# Altium schematic sheet Sheet1.SchDoc
size A2; SheetNumber: 1; SheetTotal: 1
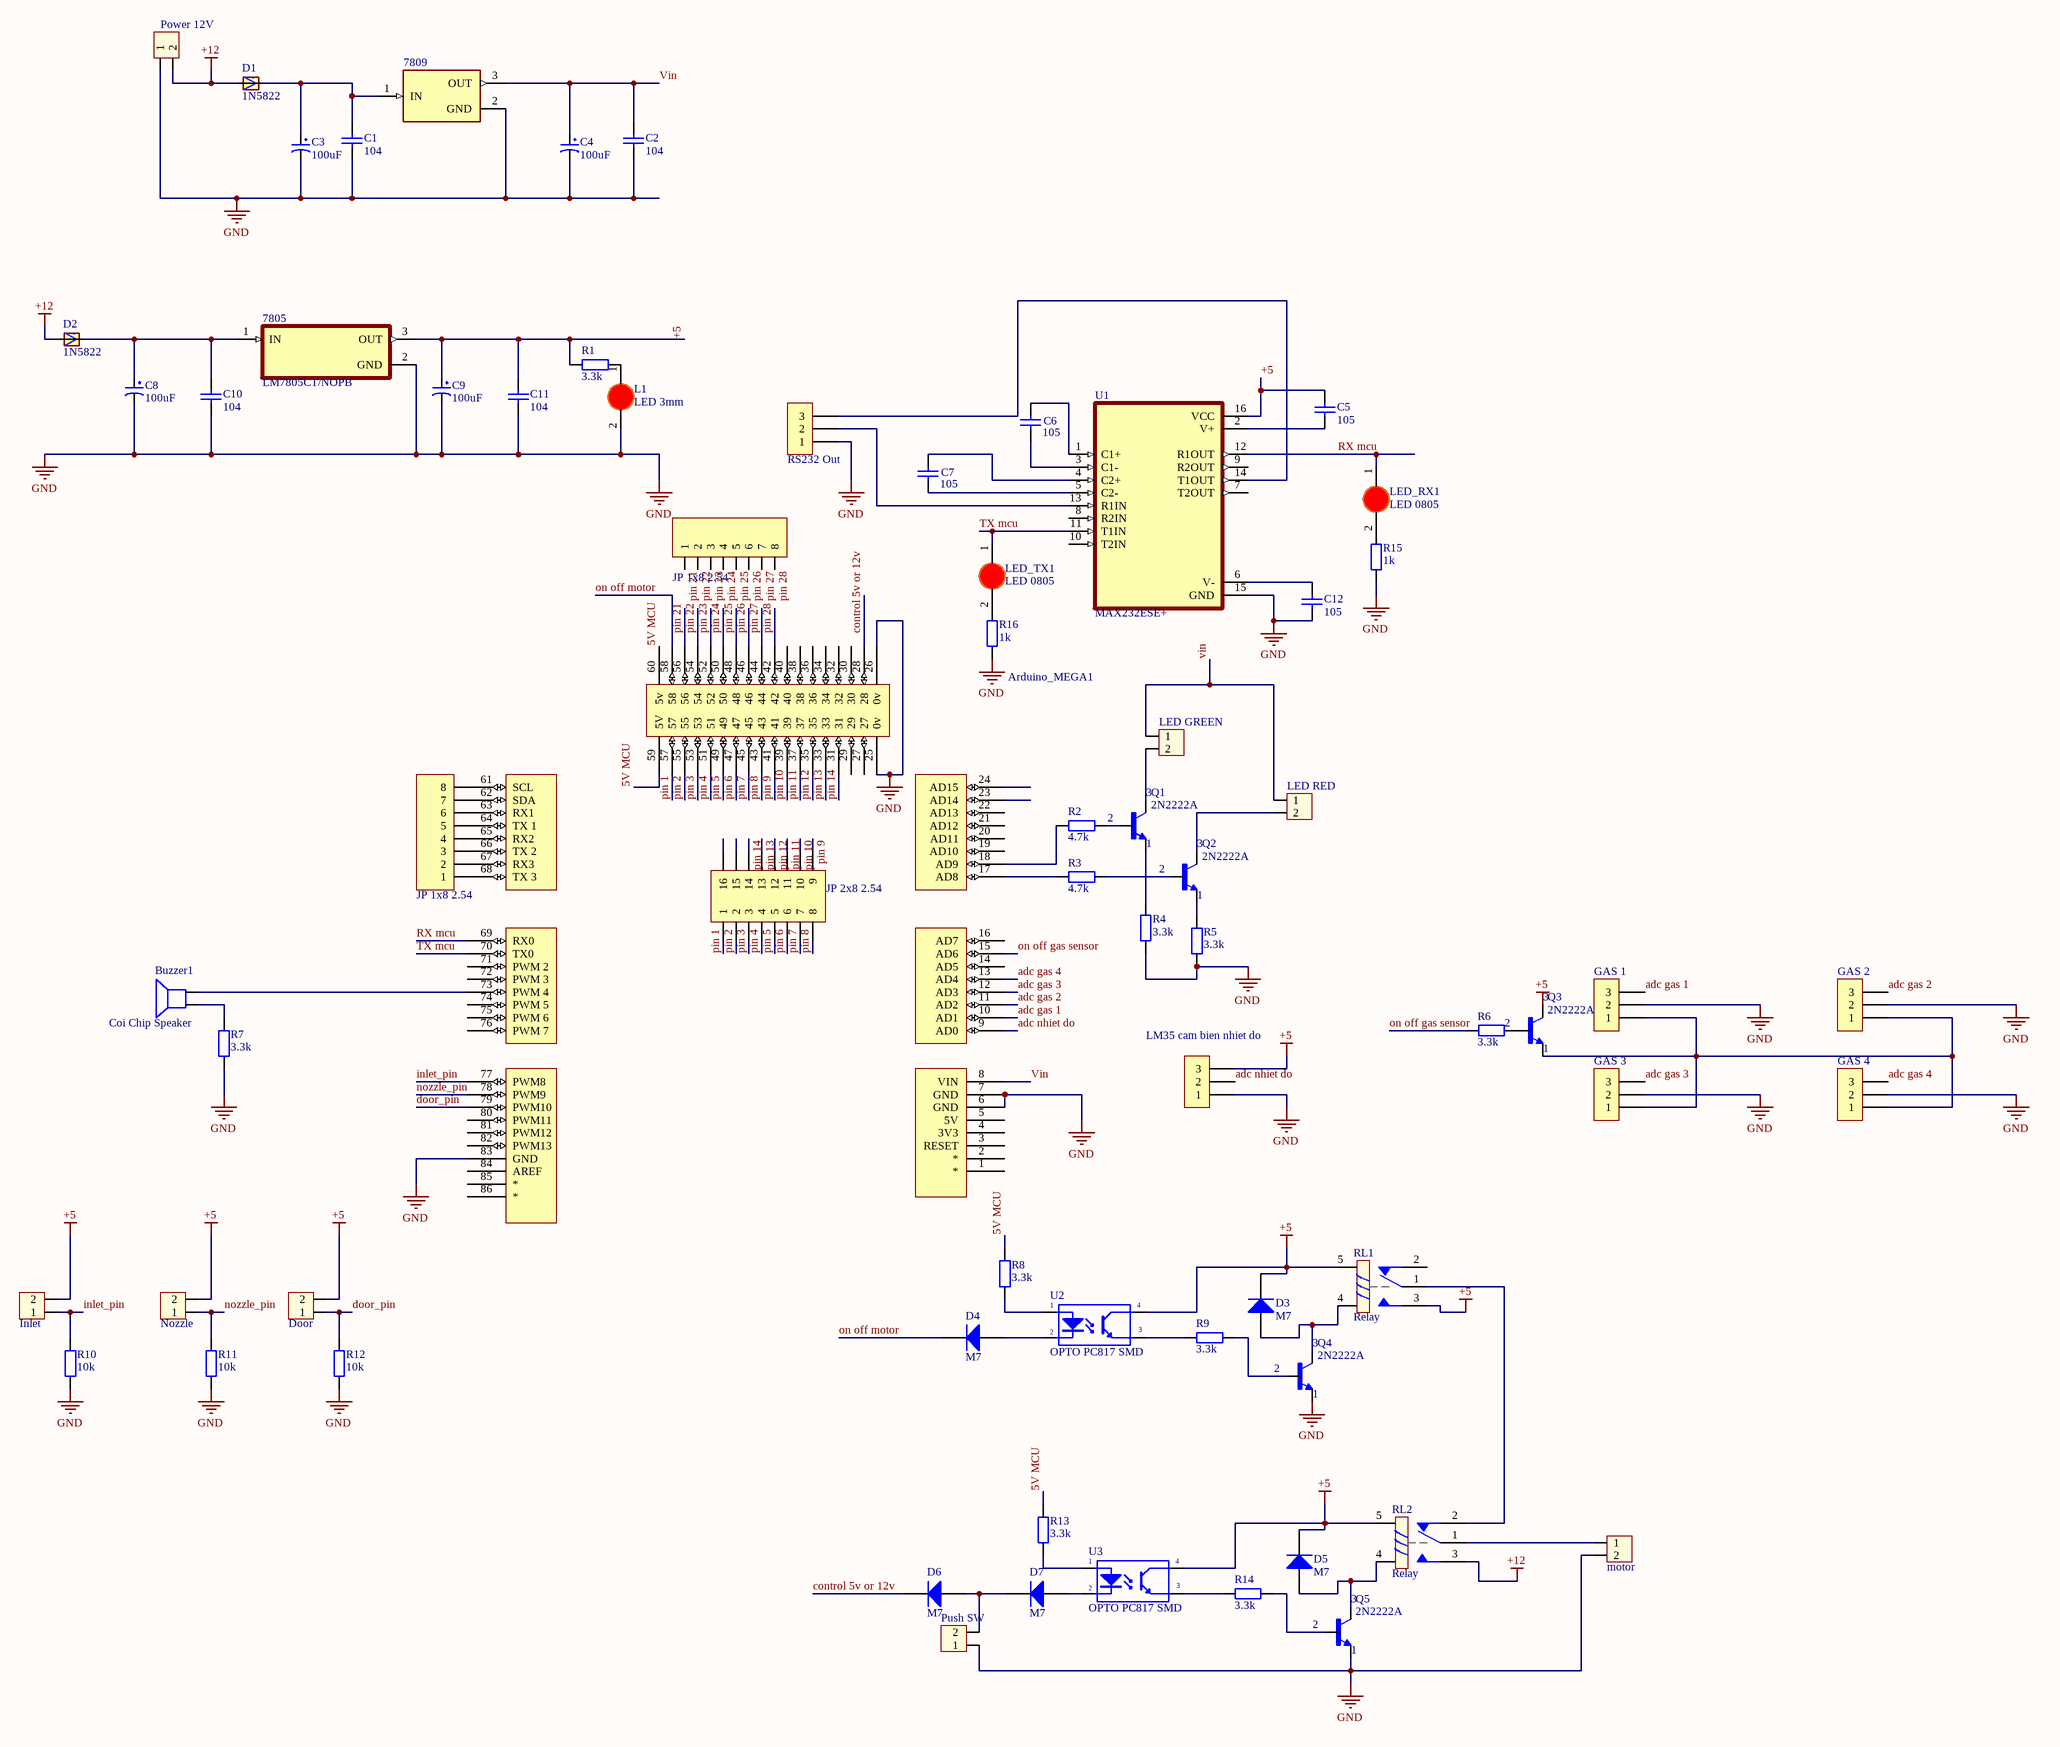
[diagram p0: Sheet1.SchDoc]

## Parts
(Parts that share a designator on the sheet are numbered #1, #2 ... from top to bottom, then left to right.)
7805  LM7805CT/NOPB  [TO254P1054X470X1955-3]
7809  LM7809CT  [TO254P470X1016X1879-3P]  (value not drawn)
Arduino_MEGA1  Arduino_MEGA?  [ArduinoMEGA_ALL]  (value not drawn)
Buzzer1  Coi Chip Speaker  [Coi Chip Speacker]
C1  104  [tu 1206]
C2  104  [tu 1206]
C3  100uF  [tu hoa 5mm]
C4  100uF  [tu hoa 5mm]
C5  105  [tu 0805]
C6  105  [tu 0805]
C7  105  [tu 0805]
C8  100uF  [tu hoa 5mm]
C9  100uF  [tu hoa 5mm]
C10  104  [tu 1206]
C11  104  [tu 1206]
C12  105  [tu 0805]
D1  1N5822  [DIOAD2120W130L950D530P]
D2  1N5822  [DIOAD2120W130L950D530P]
D3  M7  [DIODE SMA]
D4  M7  [DIODE SMA]
D5  M7  [DIODE SMA]
D6  M7  [DIODE SMA]
D7  M7  [DIODE SMA]
door1  Door  [XH2.54M-2]
GAS_1  Gas Sensor 1  [XH2.54M-3]  (value not drawn)
GAS_2  Gas Sensor 3  [XH2.54M-3]  (value not drawn)
GAS_3  Gas Sensor 2  [XH2.54M-3]  (value not drawn)
GAS_4  Gas Sensor 4  [XH2.54M-3]  (value not drawn)
H1  Power 12V  [VH3.96M-2]
H2  RS232 Out  [VH3.96M-3]
inlet1  Inlet  [XH2.54M-2]
JP1#1  JP 1x8 2.54  [JP 1x8 DT]
JP1#2  JP 2x8 2.54  [JP 2x8 CT]
JP?  JP 1x8 2.54  [JP 1x8 CT]
L1  LED 3mm  [LED-3MM-RED]
LED_GREEN  Led GREEN  [XH2.54M-2]  (value not drawn)
LED_RED  Led RED  [XH2.54M-2]  (value not drawn)
LED_RX1  LED 0805  [LED-1206-Red]
LED_TX1  LED 0805  [LED-1206-Red]
Motor1  motor  [VH3.96M-2]
nozzle1  Nozzle  [XH2.54M-2]
Push_SW  Header 2P VH3.96 Duc Thang  [VH3.96M-2]  (value not drawn)
Q1  2N2222A  [TO92254P470H750-3]
Q2  2N2222A  [TO92254P470H750-3]
Q3  2N2222A  [TO92254P470H750-3]
Q4  2N2222A  [TO92254P470H750-3]
Q5  2N2222A  [TO92254P470H750-3]
R1  3.3k  [tro smd 0805]
R2  4.7k  [tro smd 0805]
R3  4.7k  [tro smd 0805]
R4  3.3k  [tro smd 0805]
R5  3.3k  [tro smd 0805]
R6  3.3k  [tro smd 0805]
R7  3.3k  [tro smd 0805]
R8  3.3k  [tro smd 0805]
R9  3.3k  [tro smd 0805]
R10  10k  [tro smd 0805]
R11  10k  [tro smd 0805]
R12  10k  [tro smd 0805]
R13  3.3k  [tro smd 0805]
R14  3.3k  [tro smd 0805]
R15  1k  [tro smd 0805]
R16  1k  [tro smd 0805]
RL1  Relay  [Relay 5 Chan SRD]
RL2  Relay  [Relay 5 Chan SRD]
Temperature_Header1  LM35 cam bien nhiet do  [XH2.54M-3]
U1  MAX232ESE+  [SOIC127P600X175-16N]
U2  OPTO PC817 SMD  [SOP4]
U3  OPTO PC817 SMD  [SOP4]

## Nets
+5: 7805.3(OUT) C5.1 C9.1 C11.1 D3.2(K) D5.2(K) door1.2 inlet1.2 nozzle1.2 Q3.3(C) R1.2 RL1.3 RL1.5 RL2.5 Temperature_Header1.3 U1.16(VCC) U2.4(C) U3.4(C)
+12: D1.A D2.A H1.2 RL2.3
GND: 7805.2(GND) 7809.2(GND) Arduino_MEGA1.6(GND) Arduino_MEGA1.7(GND) Arduino_MEGA1.25(0v) Arduino_MEGA1.26(0v) Arduino_MEGA1.83(GND) C1.2 C2.2 C3.2 C4.2 C8.2 C9.2 C10.2 C11.2 C12.1 GAS_1.2 GAS_2.2 GAS_3.2 GAS_4.2 H1.1 H2.1 L1.2(K) Motor1.2 Push_SW.1 Q4.1(E) Q5.1(E) R4.2 R5.2 R7.1 R10.1 R11.1 R12.1 R15.1 R16.1 Temperature_Header1.1 U1.15(GND)
5V MCU: Arduino_MEGA1.59(5V) Arduino_MEGA1.60(5v) R8.2 R13.2
adc gas 1: Arduino_MEGA1.10(AD1) GAS_1.3
adc gas 2: Arduino_MEGA1.11(AD2) GAS_2.3
adc gas 3: Arduino_MEGA1.12(AD3) GAS_3.3
adc gas 4: Arduino_MEGA1.13(AD4) GAS_4.3
adc nhiet do: Arduino_MEGA1.9(AD0) Temperature_Header1.2
control 5v or 12v: Arduino_MEGA1.28 D6.2(K)
door_pin: Arduino_MEGA1.79(PWM10) door1.1 R12.2
inlet_pin: Arduino_MEGA1.77(PWM8) inlet1.1 R10.2
nozzle_pin: Arduino_MEGA1.78(PWM9) nozzle1.1 R11.2
on off gas sensor: Arduino_MEGA1.15(AD6) R6.1
on off motor: Arduino_MEGA1.58 D4.2(K)
pin 1: Arduino_MEGA1.57 JP1#2.1
pin 2: Arduino_MEGA1.55 JP1#2.2
pin 3: Arduino_MEGA1.53 JP1#2.3
pin 4: Arduino_MEGA1.51 JP1#2.4
pin 5: Arduino_MEGA1.49 JP1#2.5
pin 6: Arduino_MEGA1.47 JP1#2.6
pin 7: Arduino_MEGA1.45 JP1#2.7
pin 8: Arduino_MEGA1.43 JP1#2.8
pin 9: Arduino_MEGA1.41 JP1#2.9
pin 10: Arduino_MEGA1.39 JP1#2.10
pin 11: Arduino_MEGA1.37 JP1#2.11
pin 12: Arduino_MEGA1.35 JP1#2.12
pin 13: Arduino_MEGA1.33 JP1#2.13
pin 14: Arduino_MEGA1.31 JP1#2.14
pin 21: Arduino_MEGA1.56 JP?.1
pin 22: Arduino_MEGA1.54 JP?.2
pin 23: Arduino_MEGA1.52 JP?.3
pin 24: Arduino_MEGA1.50 JP?.4
pin 25: Arduino_MEGA1.48 JP?.5
pin 26: Arduino_MEGA1.46 JP?.6
pin 27: Arduino_MEGA1.44 JP?.7
pin 28: Arduino_MEGA1.42 JP?.8
RX mcu: Arduino_MEGA1.69(RX0) LED_RX1.1(A) U1.12(R1OUT)
TX mcu: Arduino_MEGA1.70(TX0) LED_TX1.1(A) U1.11(T1IN)
Vin: 7809.3(OUT) Arduino_MEGA1.8(VIN) C2.1 C4.1 LED_GREEN.1 LED_RED.1
Net7805_1: 7805.1(IN) C8.1 C10.1 D2.C
Net7809_1: 7809.1(IN) C1.1 C3.1 D1.C
NetArduino_MEGA1_17: Arduino_MEGA1.17(AD8) R3.1
NetArduino_MEGA1_18: Arduino_MEGA1.18(AD9) R2.1
NetArduino_MEGA1_61: Arduino_MEGA1.61(SCL) JP1#1.8
NetArduino_MEGA1_62: Arduino_MEGA1.62(SDA) JP1#1.7
NetArduino_MEGA1_63: Arduino_MEGA1.63(RX1) JP1#1.6
NetArduino_MEGA1_64: Arduino_MEGA1.64(TX_1) JP1#1.5
NetArduino_MEGA1_65: Arduino_MEGA1.65(RX2) JP1#1.4
NetArduino_MEGA1_66: Arduino_MEGA1.66(TX_2) JP1#1.3
NetArduino_MEGA1_67: Arduino_MEGA1.67(RX3) JP1#1.2
NetArduino_MEGA1_68: Arduino_MEGA1.68(TX_3) JP1#1.1
NetArduino_MEGA1_73: Arduino_MEGA1.73(PWM_4) Buzzer1.2
NetBuzzer1_1: Buzzer1.1 R7.2
NetC5_2: C5.2 U1.2(V+)
NetC6_1: C6.1 U1.1(C1+)
NetC6_2: C6.2 U1.3(C1-)
NetC7_1: C7.1 U1.4(C2+)
NetC7_2: C7.2 U1.5(C2-)
NetC12_2: C12.2 U1.6(V-)
NetD3_1: D3.1(A) Q4.3(C) RL1.4
NetD4_1: D4.1(A) U2.2(K)
NetD5_1: D5.1(A) Q5.3(C) RL2.4
NetD6_1: D6.1(A) D7.2(K) Push_SW.2
NetD7_1: D7.1(A) U3.2(K)
NetGAS_1_1: GAS_1.1 GAS_2.1 GAS_3.1 GAS_4.1 Q3.1(E)
NetH2_2: H2.2 U1.13(R1IN)
NetH2_3: H2.3 U1.14(T1OUT)
NetL1_1: L1.1(A) R1.1
NetLED_GREEN_2: LED_GREEN.2 Q1.3(C)
NetLED_RED_2: LED_RED.2 Q2.3(C)
NetLED_RX1_2: LED_RX1.2(K) R15.2
NetLED_TX1_2: LED_TX1.2(K) R16.2
NetMotor1_1: Motor1.1 RL2.1
NetQ1_1: Q1.1(E) R4.1
NetQ1_2: Q1.2(B) R2.2
NetQ2_1: Q2.1(E) R5.1
NetQ2_2: Q2.2(B) R3.2
NetQ3_2: Q3.2(B) R6.2
NetQ4_2: Q4.2(B) R9.1
NetQ5_2: Q5.2(B) R14.1
NetR8_1: R8.1 U2.1(A)
NetR9_2: R9.2 U2.3(E)
NetR13_1: R13.1 U3.1(A)
NetR14_2: R14.2 U3.3(E)
NetRL1_1: RL1.1 RL2.2

Not connected (* = marked no-connect by the designer): Arduino_MEGA1 1(*) 2(*) 3(RESET) 4(3V3) 5(5V) 14(AD5) 16(AD7) 19(AD10) 20(AD11) 21(AD12) 22(AD13) 23(AD14) 24(AD15) 27 29 30 32 34 36 38 40 71(PWM_2) 72(PWM_3) 74(PWM_5) 75(PWM_6) 76(PWM_7) 80(PWM11) 81(PWM12) 82(PWM13) 84(AREF) 85(*) 86(*); JP1#2 15 16; RL1 2; U1 7(T2OUT) 8(R2IN) 9(R2OUT) 10(T2IN)

## Library data of the parts
7809 = LM7809CT: Linear Voltage Regulator IC 1 Output 1A TO-220-3; MF: Fujitsu; MP: LM7809C; Price: None; SnapEDA_Link: https://www.snapeda.com/parts/LM7809C/Fujitsu/view-part/1233224/?ref=snap; Package: TO-220-3 Fujitsu; Value: *; Availability: Unavailable
Arduino_MEGA1 = Arduino_MEGA
Buzzer1 = Coi Chip Speaker: Còi chip
C1 C2 C10 C11 = Tu 1206 104 50V 20%: Dán; Don_Vi: Con; So_Chan: 2; Ten_Linh_Kien: Tụ 1206 104-0.1uF 20% 50V; Ma_Hang: MH004544; Chung_Loai: Dán; Kieu_Chan: *
C3 C4 C8 C9 = Tu Hoa 100uF 25V 6x11: Cắm; Don_Vi: Con; So_Chan: 2; Ten_Linh_Kien: Tụ Hóa 100uF 25V 6x11MM; Ma_Hang: MH001351; Chung_Loai: Cắm; Kieu_Chan: *
C5-C7 C12 = Tu 0805 105 50V 10%: Dán; Don_Vi: Con; So_Chan: 2; Ten_Linh_Kien: Tụ 0805 105-1uF 10% 50V; Ma_Hang: MH004552; Chung_Loai: Dán; Kieu_Chan: *
D1 D2 = 1N5822: Diode Schottky 40 V 3A Through Hole DO-201AD; MF: STMicroelectronics; Value: *; SnapEDA_Link: https://www.snapeda.com/parts/1N5822/STMicroelectronics/view-part/?ref=snap; Purchase-URL: https://pricing.snapeda.com/search/part/1N5822/?ref=eda; Availability: In Stock; Price: None; Package: DO-201 STMicroelectronics; Check_prices: https://www.snapeda.com/parts/1N5822/STMicroelectronics/view-part/?ref=eda; MP: 1N5822
D3-D7 = Diode M7 ( 4007 ): Dán; Don_Vi: Con; Ten_Linh_Kien: Diode M7 1N4007 SMD 1A 1000V; Ma_Hang: MH000944; Chung_Loai: Dán; Ghi_Chu: *
door1 inlet1 LED_GREEN LED_RED nozzle1 = Header 2P 2.54 Duc Thang: Cắm; Ten_Linh_Kien: Header 2P XH2.54-2P Đực Thẳng; Don_Vi: Con; Ma_Hang: MH001283; Chung_Loai: Cắm
GAS_1-GAS_4 Temperature_Header1 = Header 3P 2.54 Duc Thang: Cắm; Ten_Linh_Kien: Header 3P XH2.54-3P Đực Thẳng; Don_Vi: Con; Ma_Hang: MH001292; Chung_Loai: Cắm
H1 Motor1 Push_SW = Header 2P VH3.96 Duc Thang: Cắm; Ten_Linh_Kien: Header 2P XH2.54-2P Đực Thẳng; Don_Vi: Con; Ma_Hang: MH001283; Chung_Loai: Cắm
H2 = Header 3P VH3.96 Duc Thang: Cắm; Ten_Linh_Kien: Header 3P XH2.54-3P Đực Thẳng; Don_Vi: Con; Ma_Hang: MH001292; Chung_Loai: Cắm
JP1#1 = JP 1x8 2.54 Duc Thang: Cắm; Ten_Linh_Kien: Jump Đơn Đực 2.54MM 1x40P Thẳng 11MM; Don_Vi: Con; Ma_Hang: MH000903; Ghi_Chu: *; Kieu_Chan: *; Chung_Loai: Cắm
JP1#2 = JP 2x8 2.54 Cai Thang: Cắm; Ten_Linh_Kien: Jump Đôi Cái 2.54MM 2x20P Thẳng; Don_Vi: Con; Ma_Hang: MH008647; Ghi_Chu: *; Kieu_Chan: *; Chung_Loai: Cắm
JP? = JP 1x8 2.54 Cai Thang: Cắm; Ten_Linh_Kien: Jump Đơn Cái 2.54MM 1x20P Thẳng; Don_Vi: Con; Ma_Hang: MH004006; Ghi_Chu: *; Kieu_Chan: *; Chung_Loai: Cắm
L1 = LED 3mm Do: Cắm; Don_Vi: Con; Ma_Hang: MH003892; Ten_Linh_Kien: Led 3MM Phủ Đỏ (10c); Ghi_Chu: *; Kieu_Chan: *; Chung_Loai: Cắm
LED_RX1 LED_TX1 = LED 1206 Do: Dán; Don_Vi: Con; Ma_Hang: MH002334; Ten_Linh_Kien: LED1206 Màu Đỏ (Red); Ghi_Chu: *; Kieu_Chan: *; Chung_Loai: Dán
Q1-Q5 = 2N2222A: Bipolar (BJT) Transistor NPN 40 V 600 mA 250MHz 625 mW Through Hole TO-92; MF: Diotec Semiconductor; Package: TO-92-3 Diotec; Check_prices: https://www.snapeda.com/parts/2N2222A/Diotec/view-part/?ref=eda; Value: *; Purchase-URL: https://pricing.snapeda.com/search/part/2N2222A/?ref=eda; Availability: In Stock; SnapEDA_Link: https://www.snapeda.com/parts/2N2222A/Diotec/view-part/?ref=snap; MP: 2N2222A; Price: None
R1 R4-R9 R13 R14 = Tro 0805 1% 3.3k: Dán; Don_Vi: Con; So_Chan: 2; Ten_Linh_Kien: Trở 0805 1% 3.3k; Ma_Hang: MH005472; Chung_Loai: Dán; Kieu_Chan: *
R2 R3 = Tro 0805 5% 4.7k: Dán; Don_Vi: Con; So_Chan: 2; Ten_Linh_Kien: Trở 0805 5% 4.7k; Ma_Hang: MH005307; Chung_Loai: Dán; Kieu_Chan: *
R10-R12 = Tro 0805 5% 10k: Dán; Don_Vi: Con; So_Chan: 2; Ten_Linh_Kien: Trở 0805 5% 10k; Ma_Hang: MH005239; Chung_Loai: Dán; Kieu_Chan: *
R15 R16 = Tro 0805 5% 1k: Dán; Don_Vi: Con; So_Chan: 2; Ten_Linh_Kien: Trở 0805 5% 1k; Ma_Hang: MH005234; Chung_Loai: Dán; Kieu_Chan: *
RL1 RL2 = Relay 5 Chan SRD: Relay 5 Chan; Ma_Hang: MH009374; Ten: Relay 5V10A SRD-05VDC-SL-C Chính Hãng
U1 = MAX232ESE+: 2/2 Transceiver Full RS232 16-SOIC; MF: Maxim Integrated; Value: *; Availability: Warning; Price: None; Check_prices: https://www.snapeda.com/parts/MAX232ESE+/Maxim%20Integrated/view-part/7706/?ref=eda; Purchase-URL: https://pricing.snapeda.com/search/part/MAX232ESE+/?ref=eda; Package: SOIC-16 Maxim; MP: MAX232ESE+; SnapEDA_Link: https://www.snapeda.com/parts/MAX232ESE+/Maxim%20Integrated/view-part/7706/?ref=snap
U2 U3 = OPTO PC817 SMD: Single Opto; Value: PC817
7805 = LM7805CT/NOPB: Price: None; MP: LM7805CT/NOPB; Availability: Unavailable; Value: *; Package: None